# Altium schematic sheet lpGBT-Elinks-Servant.SchDoc: Servant E-links
size A; DocumentNumber: 12; SheetNumber: 14; SheetTotal: 21
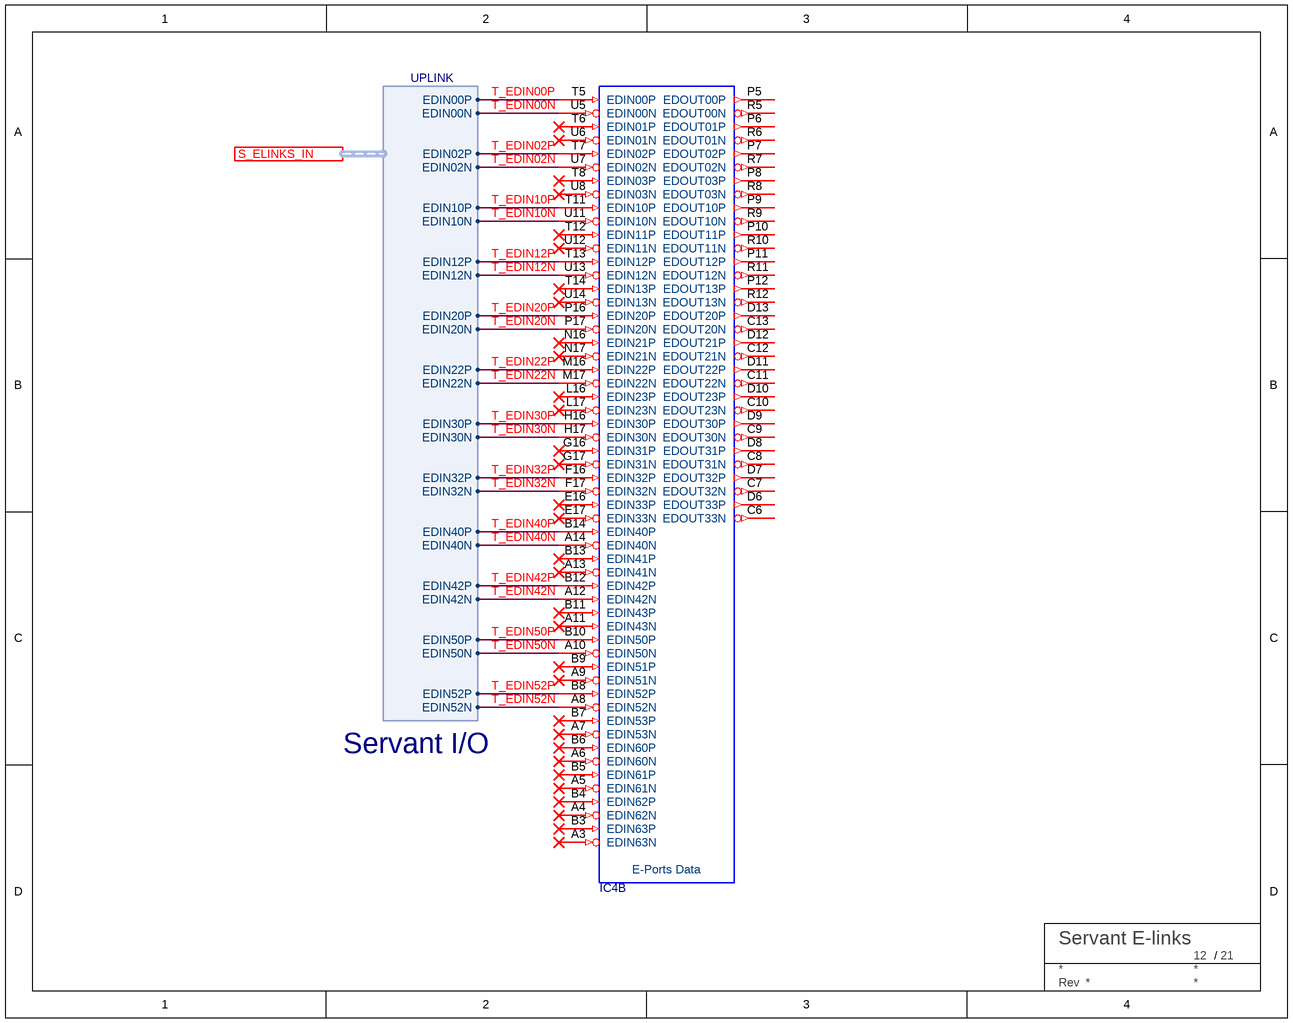
[diagram p0: lpGBT-Elinks-Servant.SchDoc]

## Parts
IC4  LPGBT  [BGA289X17]  (value not drawn)  (part B of 8)
TBLOCK?  BU Title block  (value not drawn)  (graphical)

## Ports
S_ELINKS_IN (harness UPLINK)

## Harnesses
UPLINK: EDIN00P, EDIN00N, EDIN02P, EDIN02N, EDIN10P, EDIN10N, EDIN12P, EDIN12N, EDIN20P, EDIN20N, EDIN22P, EDIN22N, EDIN30P, EDIN30N, EDIN32P, EDIN32N, EDIN40P, EDIN42P, EDIN50P, EDIN52P, EDIN52N, EDIN50N, EDIN42N, EDIN40N

## Nets
T_EDIN00N: IC4.U5(EDIN00N) ; port S_ELINKS_IN.EDIN00N
T_EDIN00P: IC4.T5(EDIN00P) ; port S_ELINKS_IN.EDIN00P
T_EDIN02N: IC4.U7(EDIN02N) ; port S_ELINKS_IN.EDIN02N
T_EDIN02P: IC4.T7(EDIN02P) ; port S_ELINKS_IN.EDIN02P
T_EDIN10N: IC4.U11(EDIN10N) ; port S_ELINKS_IN.EDIN10N
T_EDIN10P: IC4.T11(EDIN10P) ; port S_ELINKS_IN.EDIN10P
T_EDIN12N: IC4.U13(EDIN12N) ; port S_ELINKS_IN.EDIN12N
T_EDIN12P: IC4.T13(EDIN12P) ; port S_ELINKS_IN.EDIN12P
T_EDIN20N: IC4.P17(EDIN20N) ; port S_ELINKS_IN.EDIN20N
T_EDIN20P: IC4.P16(EDIN20P) ; port S_ELINKS_IN.EDIN20P
T_EDIN22N: IC4.M17(EDIN22N) ; port S_ELINKS_IN.EDIN22N
T_EDIN22P: IC4.M16(EDIN22P) ; port S_ELINKS_IN.EDIN22P
T_EDIN30N: IC4.H17(EDIN30N) ; port S_ELINKS_IN.EDIN30N
T_EDIN30P: IC4.H16(EDIN30P) ; port S_ELINKS_IN.EDIN30P
T_EDIN32N: IC4.F17(EDIN32N) ; port S_ELINKS_IN.EDIN32N
T_EDIN32P: IC4.F16(EDIN32P) ; port S_ELINKS_IN.EDIN32P
T_EDIN40N: IC4.A14(EDIN40N) ; port S_ELINKS_IN.EDIN40N
T_EDIN40P: IC4.B14(EDIN40P) ; port S_ELINKS_IN.EDIN40P
T_EDIN42N: IC4.A12(EDIN42N) ; port S_ELINKS_IN.EDIN42N
T_EDIN42P: IC4.B12(EDIN42P) ; port S_ELINKS_IN.EDIN42P
T_EDIN50N: IC4.A10(EDIN50N) ; port S_ELINKS_IN.EDIN50N
T_EDIN50P: IC4.B10(EDIN50P) ; port S_ELINKS_IN.EDIN50P
T_EDIN52N: IC4.A8(EDIN52N) ; port S_ELINKS_IN.EDIN52N
T_EDIN52P: IC4.B8(EDIN52P) ; port S_ELINKS_IN.EDIN52P

Not connected (* = marked no-connect by the designer): IC4 A3(EDIN63N)* A4(EDIN62N)* A5(EDIN61N)* A6(EDIN60N)* A7(EDIN53N)* A9(EDIN51N)* A11(EDIN43N)* A13(EDIN41N)* B3(EDIN63P)* B4(EDIN62P)* B5(EDIN61P)* B6(EDIN60P)* B7(EDIN53P)* B9(EDIN51P)* B11(EDIN43P)* B13(EDIN41P)* C6(EDOUT33N) C7(EDOUT32N) C8(EDOUT31N) C9(EDOUT30N) C10(EDOUT23N) C11(EDOUT22N) C12(EDOUT21N) C13(EDOUT20N) D6(EDOUT33P) D7(EDOUT32P) D8(EDOUT31P) D9(EDOUT30P) D10(EDOUT23P) D11(EDOUT22P) D12(EDOUT21P) D13(EDOUT20P) E16(EDIN33P)* E17(EDIN33N)* G16(EDIN31P)* G17(EDIN31N)* L16(EDIN23P)* L17(EDIN23N)* N16(EDIN21P)* N17(EDIN21N)* P5(EDOUT00P) P6(EDOUT01P) P7(EDOUT02P) P8(EDOUT03P) P9(EDOUT10P) P10(EDOUT11P) P11(EDOUT12P) P12(EDOUT13P) R5(EDOUT00N) R6(EDOUT01N) R7(EDOUT02N) R8(EDOUT03N) R9(EDOUT10N) R10(EDOUT11N) R11(EDOUT12N) R12(EDOUT13N) T6(EDIN01P)* T8(EDIN03P)* T12(EDIN11P)* T14(EDIN13P)* U6(EDIN01N)* U8(EDIN03N)* U12(EDIN11N)* U14(EDIN13N)*

## Notes on the sheet
- Servant I/O
- (in symbol LPGBT, part B) E-Ports Data
- (in symbol TITLE_BLOCK_BU) /; Rev

## Library data of the parts
IC4 = LPGBT: Low Power Gigabit Transceiver; Manufacturer: CERN; Pinout Version: 180226; Bonding: No; Device: LPGBT; Manufacturer Part Number: LPGBT; SMD: Yes; Mounted: Yes; LatestRevisionDate: 26.10.2018; PackageDescription: BGA, 289-Leads, Body 9.00x9.00mmx1.28mm, Pitch 0.50mm; Part Description: Low Power Gigabit Transceiver; Case: BGA289; Part Number: LPGBT; Pin Count: 289; Socket: No; Component Kind: Standard; Component Type: Standard; Footprint: BGA289C50P17X17_900X900X128
TBLOCK? = TITLE_BLOCK_BU